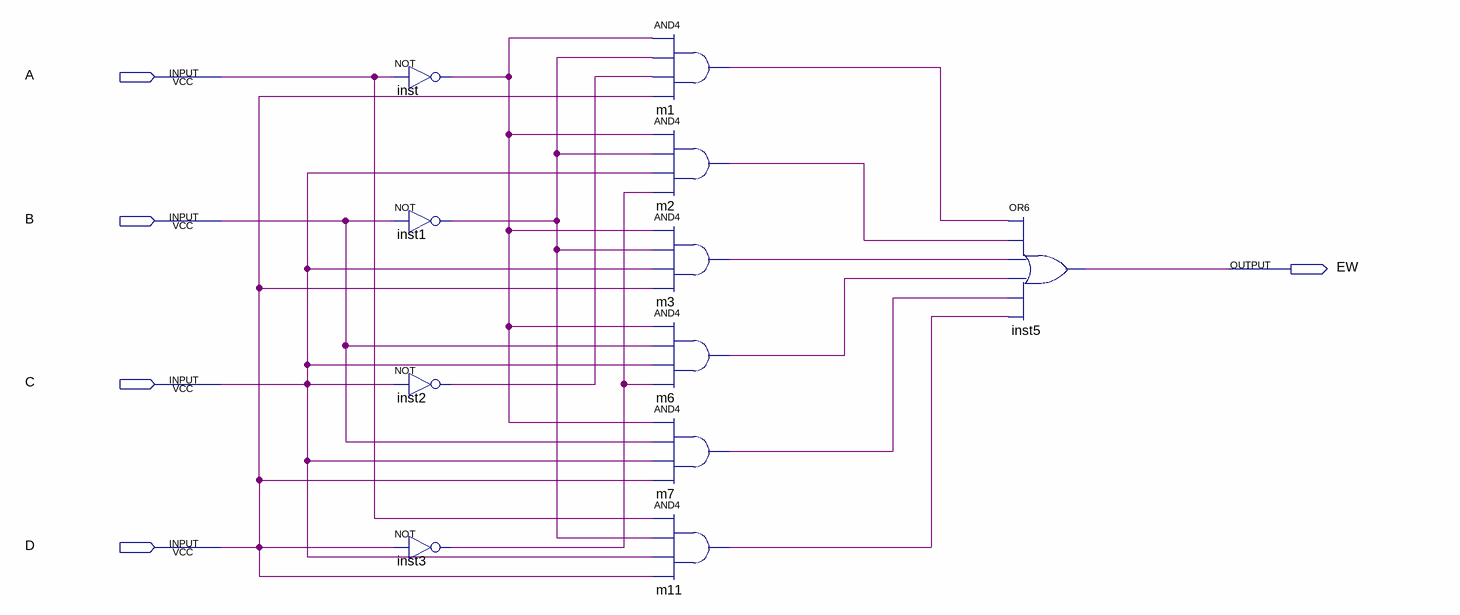
[diagram p0: schematic sheet]
// Quartus schematic EW_SOP.bdf as structural Verilog: 11 symbols, 5 pins
module EW_SOP (
  input  A,
  input  B,
  input  C,
  input  D,
  output EW
);

  wire inst1_out, inst2_out, inst3_out, inst_out, m1_out, m2_out, m3_out, m6_out, m7_out, m11_out;

  not inst (inst_out, A);
  not inst1 (inst1_out, B);
  not inst2 (inst2_out, C);
  not inst3 (inst3_out, D);
  and m1 (m1_out, inst_out, inst1_out, inst2_out, D);
  and m2 (m2_out, inst_out, inst1_out, C, inst3_out);
  and m3 (m3_out, inst_out, inst1_out, C, D);
  and m6 (m6_out, inst_out, B, C, inst3_out);
  and m7 (m7_out, inst_out, B, C, D);
  and m11 (m11_out, A, inst1_out, C, D);
  or inst5 (EW, m1_out, m2_out, m3_out, m6_out, m7_out, m11_out);
endmodule
